# EAGLE design LSA (EAGLE 8.5.2)
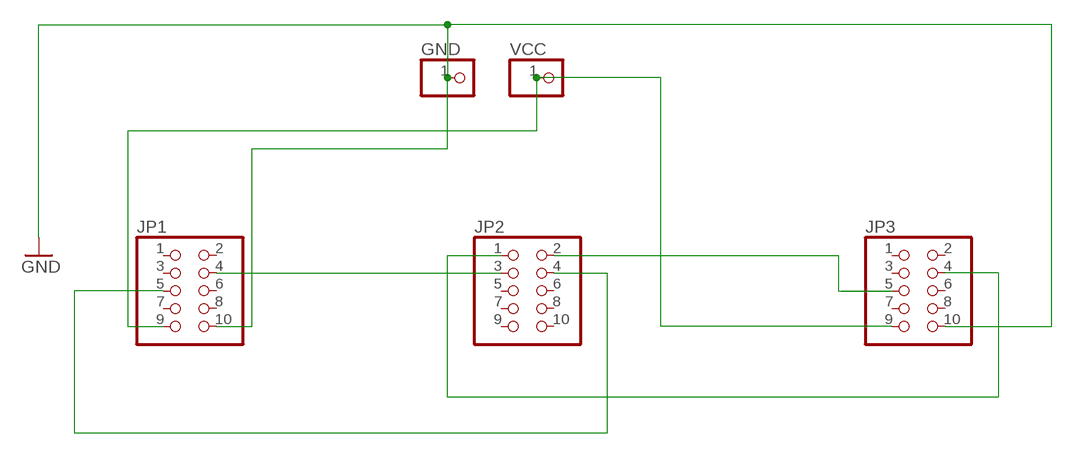
[diagram p0: schematic, sheet 1]

## Parts
GND  PINHD-1X1  [1X01]
JP1  PINHD-2X5  [2X05]
JP2  PINHD-2X5  [2X05]
JP3  PINHD-2X5  [2X05]
VCC  PINHD-1X1  [1X01]

## Nets
GND: GND.1 JP1.10 JP3.10
N$1: JP2.2 JP3.5
N$2: JP1.5 JP2.4
N$3: JP1.9 JP3.9 VCC.1
N$4: JP1.4 JP2.3
N$5: JP2.1 JP3.4
Unconnected: JP1.1 JP1.2 JP1.3 JP1.6 JP1.7 JP1.8 JP2.5 JP2.6 JP2.7 JP2.8 JP2.9 JP2.10 JP3.1 JP3.2 JP3.3 JP3.6 JP3.7 JP3.8

## Library data of the parts
GND VCC = pinhead:PINHD-1X1: PIN HEADER
JP1-JP3 = pinhead:PINHD-2X5: PIN HEADER

## Board
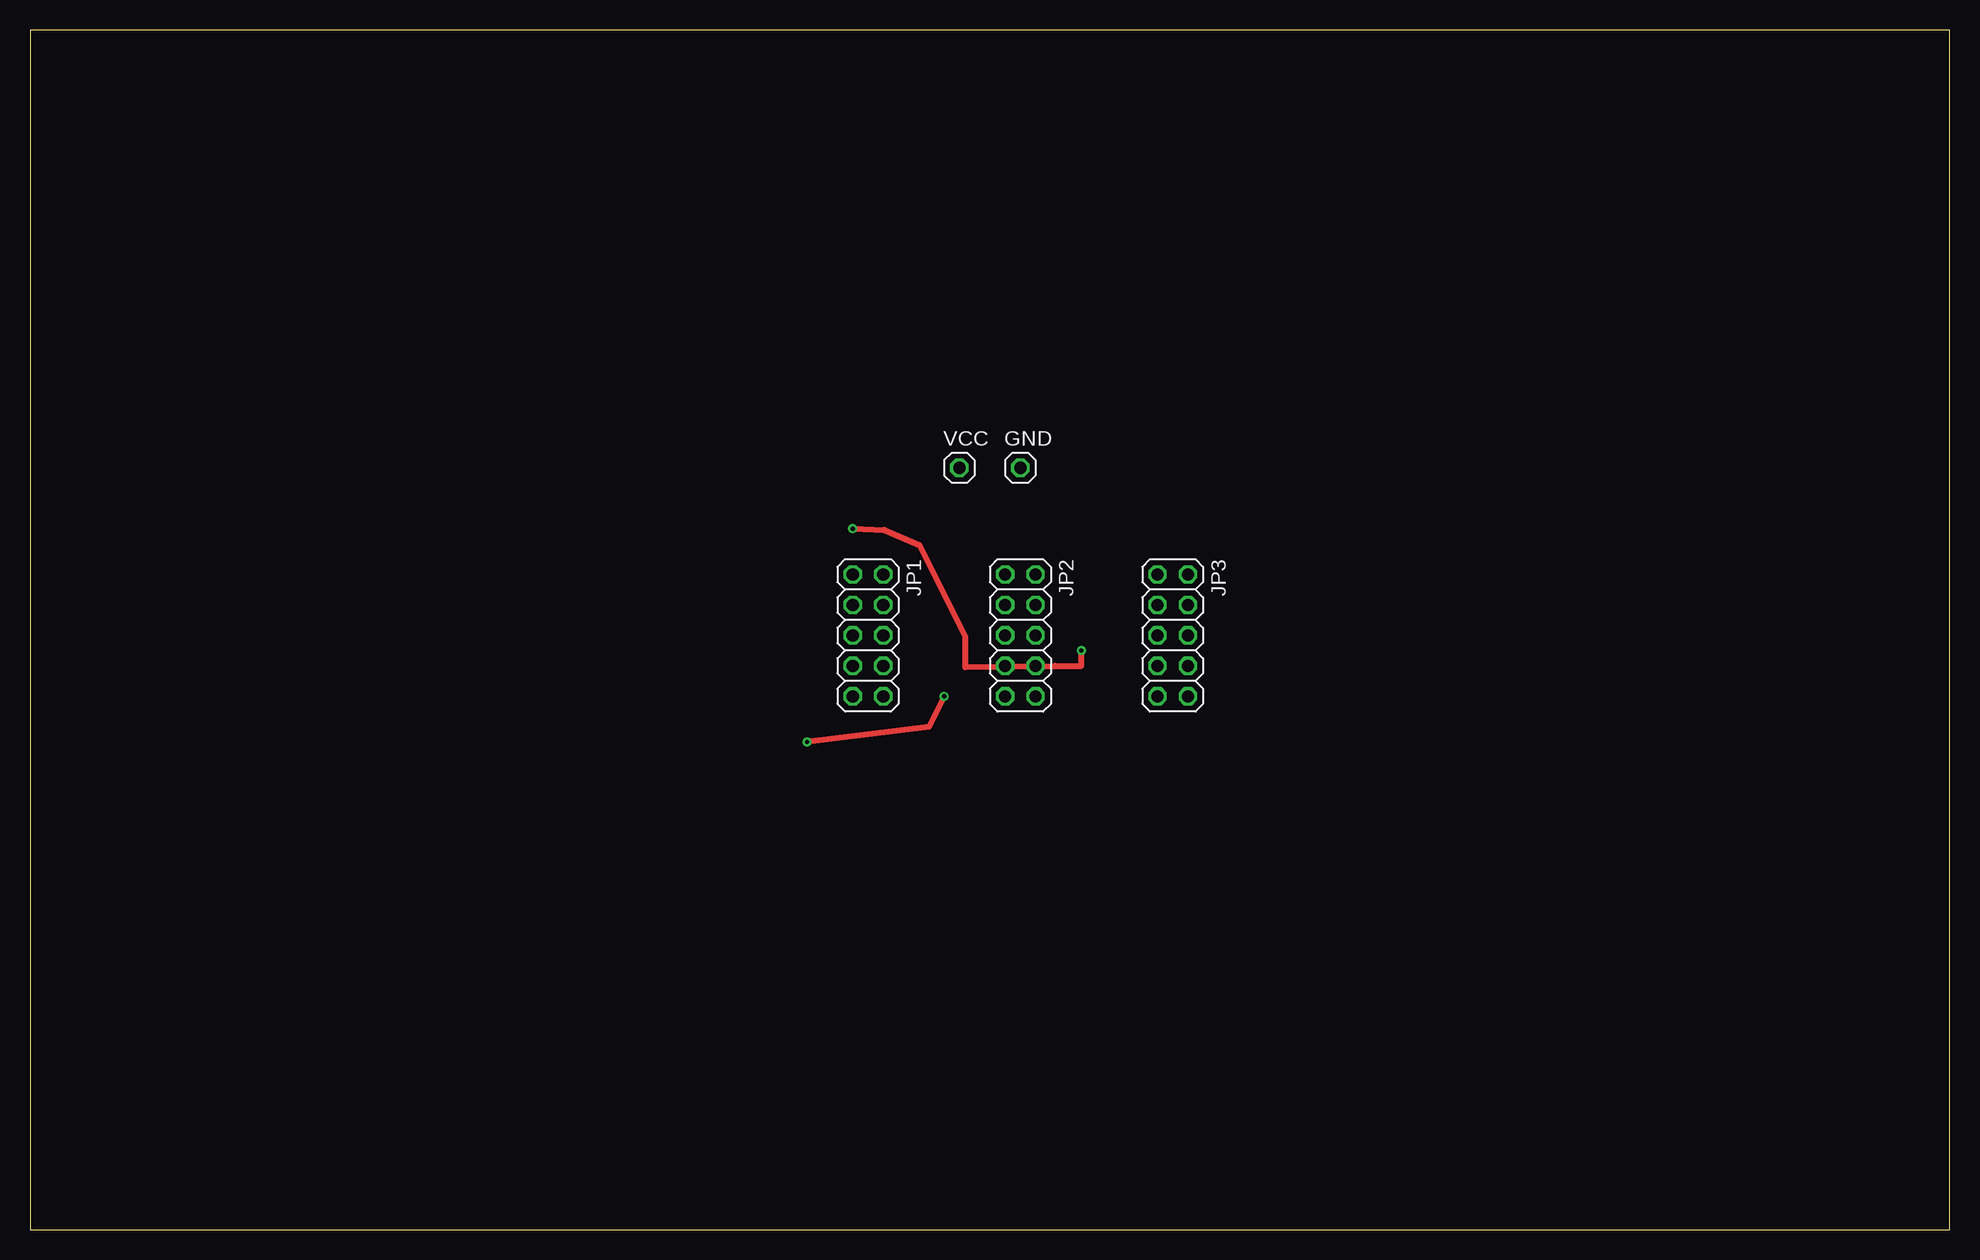
[diagram p1: board, top side]
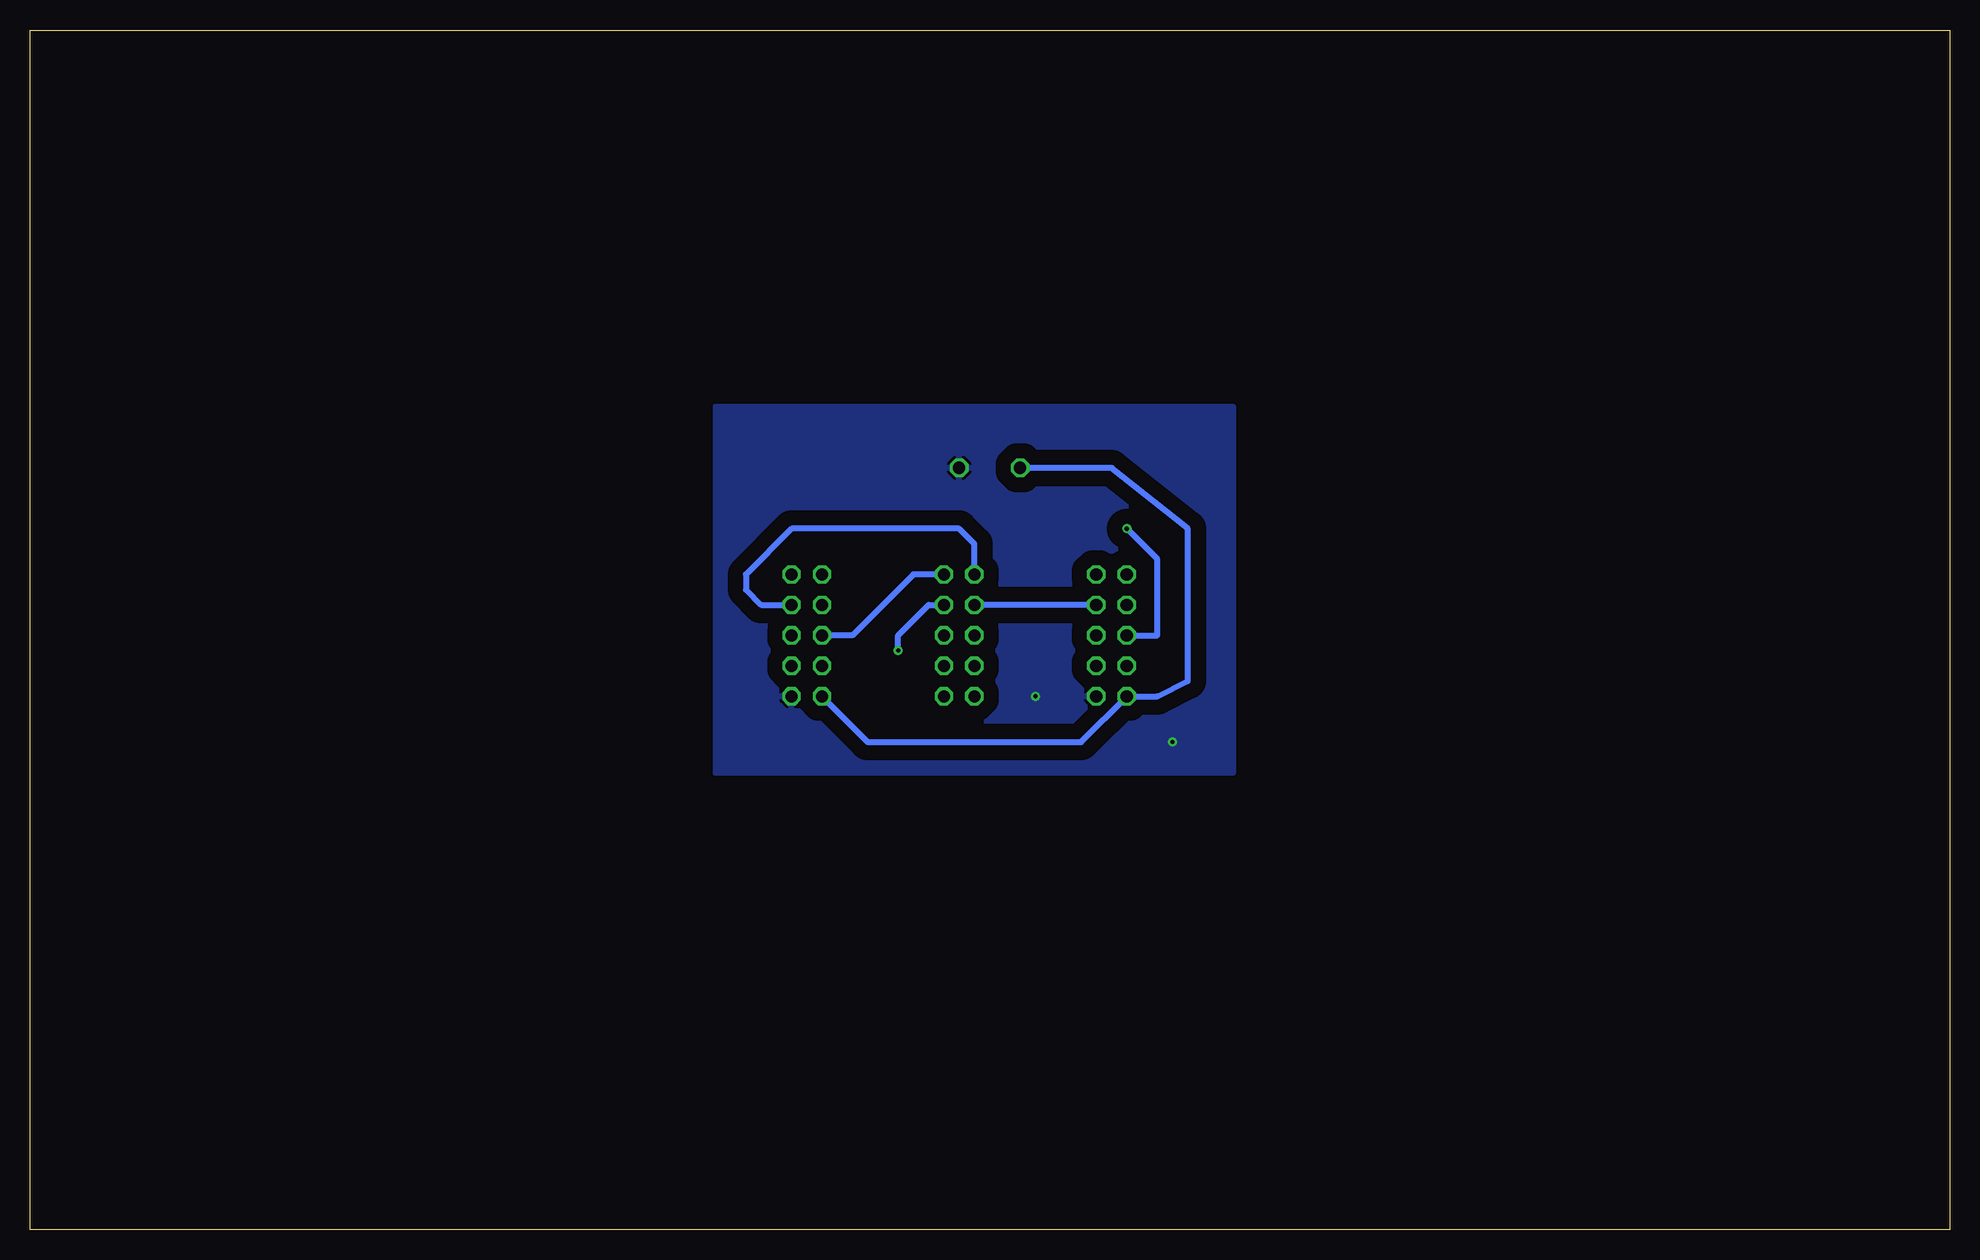
[diagram p2: board, bottom side, seen from below]

Size 160 x 100 mm. Coordinates in mm from the lower left corner, seen from the top.
Outline: 0,0 160,0 160,100 0,100 0,0
Copper layers (1*16): Top 0.035mm / dielectric 1.5mm / Bottom 0.035mm
Design rules "default": minimum track width 6mil, minimum drill 0.35mm, track to track 6mil, track to pad 6mil, pad to pad 6mil, via to via 6mil, smd to smd 6mil, copper to edge 40mil, drill to drill 6mil, minimum pad ring 10mil, minimum via ring 8mil, stop-mask expansion 4mil, vias tented up to drill 0mil, thermal gap 10mil

### Footprints (pad centres in the part's own frame; a part is rotated, then mirrored left to right if it is on the bottom)
1X01 = drill 1.016 octagon: 1 0,0
2X05 = drill 1.016 octagon: 1 -5.08,-1.27; 2 -5.08,1.27; 3 -2.54,-1.27; 4 -2.54,1.27; 5 0,-1.27; 6 0,1.27; 7 2.54,-1.27; 8 2.54,1.27; 9 5.08,-1.27; 10 5.08,1.27

### Placement (x,y rotation side)
GND  82.55,63.5 0 top
JP1  69.85,49.53 270 top
JP2  82.55,49.53 270 top
JP3  95.25,49.53 270 top
VCC  77.47,63.5 0 top

### Tracks (layer width: path | path; a pad name or v marks a point on that pad's centre or on a via)
GND  (via drill 0.35)
  Top 0.508: v76.2,44.45 74.93,41.91 v64.77,40.64
  pour Bottom (isolate 1.27): 59.69,68.58 102.87,68.58 102.87,38.1 59.69,38.1
N$1
  Bottom 0.508: JP2.2 86.36,54.61 91.44,49.53 JP3.5
N$2  (via drill 0.35)
  Top 0.508: v68.58,58.42 71.22,58.32 74.14,57.05 77.95,49.43 77.95,46.89 85.47,46.99 87.63,46.99 v87.63,48.26
  Bottom 0.508: JP1.5 66.04,49.53 66.04,55.88 v68.58,58.42 | v87.63,48.26 87.63,49.53 85.09,52.07 JP2.4
N$3
  Bottom 0.508: VCC.1 69.85,63.5 63.5,58.42 63.5,45.72 66.04,44.45 JP1.9 72.39,40.64 90.17,40.64 JP3.9
N$4
  Bottom 0.508: JP1.4 JP2.3
N$5
  Bottom 0.508: JP2.1 81.28,57.15 82.55,58.42 96.52,58.42 100.33,54.61 100.33,53.34 99.06,52.07 JP3.4